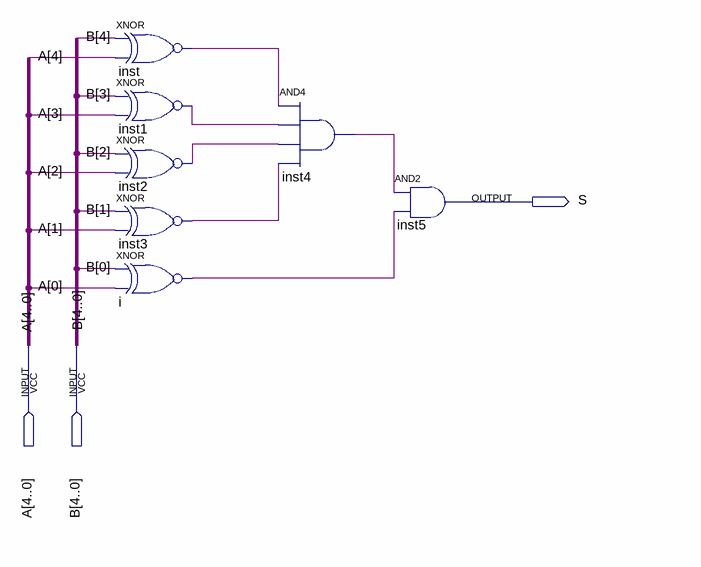
[diagram p0: schematic sheet]
// Quartus schematic Comp_equal.bdf as structural Verilog: 7 symbols, 3 pins
module Comp_equal (
  input  [4:0] A,
  input  [4:0] B,
  output S
);

  wire i_out, inst1_out, inst2_out, inst3_out, inst4_out, inst_out;

  xnor inst (inst_out, B[4], A[4]);
  xnor inst1 (inst1_out, B[3], A[3]);
  xnor inst2 (inst2_out, B[2], A[2]);
  xnor inst3 (inst3_out, B[1], A[1]);
  xnor i (i_out, B[0], A[0]);
  and inst4 (inst4_out, inst_out, inst1_out, inst2_out, inst3_out);
  and inst5 (S, inst4_out, i_out);
endmodule
